# EasyEDA schematic HW1_32.json
TITLE: Sheet_1; REV: 1.0; Date: 2020-11-04; Sheet: 1/1; Drawn By: gokbeykeskin_4066; Company: Your Company
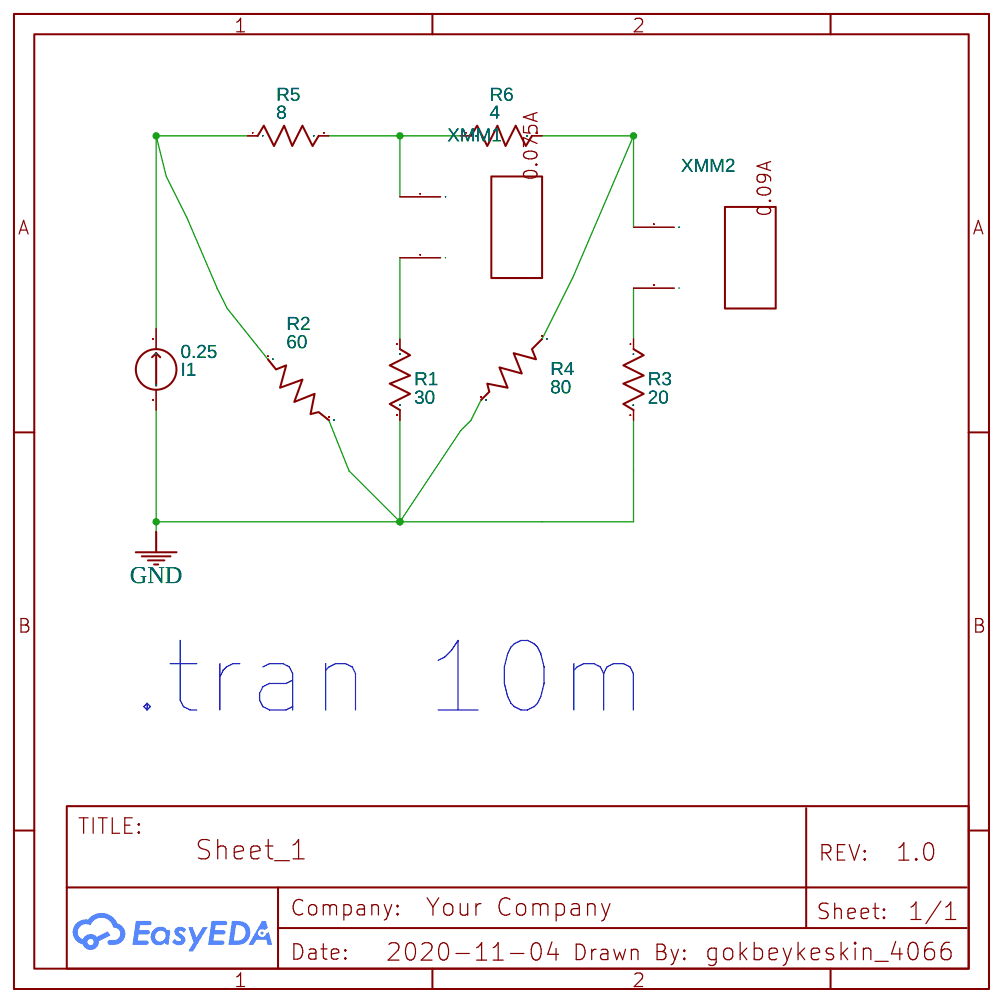
[diagram p0: schematic sheet]

## Parts
I1  0.25  [2P-5.08]
R1  30  [AXIAL-0.3]
R2  60  [AXIAL-0.3]
R3  20  [AXIAL-0.3]
R4  80  [AXIAL-0.3]
R5  8  [AXIAL-0.3]
R6  4  [AXIAL-0.3]
XMM1  Multimeter
XMM2  Multimeter

## Library data of the parts
I1 = IDC: Contributor: EasyEDA; sim: true
R1 R3 R5 R6 = Resistor_US: Resistance: 1k; Contributor: EasyEDA; Supplier: YUJING
R2 R4 = Resistor_45Degree_US: Supplier: YUJING; Contributor: EasyEDA; Resistance: 1K
XMM1 XMM2 = MULTIMETER: Supplier: LCSC; Multimeter Type: Amper; Power Type: AC; Voltmeter resistance: 10μ; Ammeter resistance: 1G; NameDisplay: 0; Contributor: EasyEDA; sim: true

## Nets
GND: I1.1 R1.2 R2.2 R3.2 R4.2
Net-(I1-2): I1.2 R2.1 R5.1
Net-(R1-1): R1.1 XMM1.2(I)
Net-(R3-1): R3.1 XMM2.2(I)
Net-(R4-1): R4.1 R6.2 XMM2.1(+)
Net-(R5-2): R5.2 R6.1 XMM1.1(+)

## Notes on the sheet
- .tran 10m
